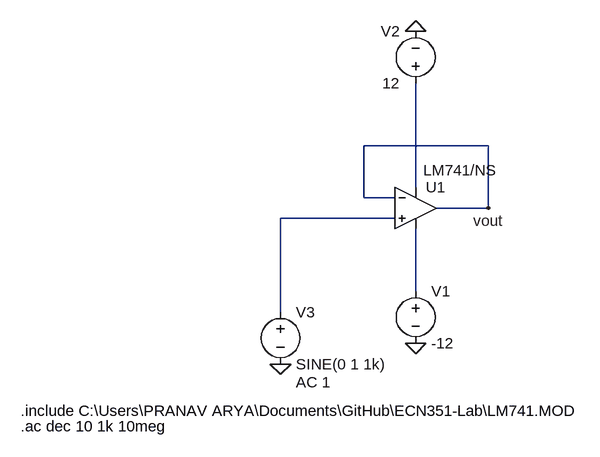
[diagram p0: schematic Vlotage-Follower.asc]
Vlotage-Follower.asc, the LTspice schematic file:
Version 4
SHEET 1 880 680
WIRE 384 32 192 32
WIRE 272 96 272 -64
WIRE 192 112 192 32
WIRE 240 112 192 112
WIRE 384 128 384 32
WIRE 384 128 304 128
WIRE 240 144 64 144
WIRE 272 256 272 160
WIRE 64 288 64 144
FLAG 272 336 0
FLAG 272 -144 0
FLAG 64 368 0
FLAG 384 128 vout
SYMBOL OpAmps\\opamp2 272 64 R0
WINDOW 3 12 6 Left 2
SYMATTR Value LM741/NS
SYMATTR InstName U1
SYMBOL voltage 272 240 R0
WINDOW 123 0 0 Left 0
WINDOW 39 0 0 Left 0
SYMATTR InstName V1
SYMATTR Value -12
SYMBOL voltage 272 -48 R180
WINDOW 0 24 96 Left 2
WINDOW 3 24 16 Left 2
WINDOW 123 0 0 Left 0
WINDOW 39 0 0 Left 0
SYMATTR InstName V2
SYMATTR Value 12
SYMBOL voltage 64 272 R0
WINDOW 123 24 124 Left 2
WINDOW 39 0 0 Left 0
SYMATTR Value2 AC 1
SYMATTR InstName V3
SYMATTR Value SINE(0 1 1k)
TEXT -336 440 Left 2 !.include C:\\Users\\PRANAV ARYA\\Documents\\GitHub\\ECN351-Lab\\LM741.MOD
TEXT -336 464 Left 2 !.ac dec 10 1k 10meg

The netlist it stands for:
* Vlotage-Follower.asc
XU1 N002 vout N001 N003 vout LM741/NS  ; pins In+ In- V+ V- OUT
V1 N003 0 -12
V2 N001 0 12
V3 N002 0 SINE(0 1 1k) AC 1
.include C:\Users\PRANAV ARYA\Documents\GitHub\ECN351-Lab\LM741.MOD
.ac dec 10 1k 10meg
.backanno
.end